# Altium schematic sheet ECAL-TEST-INPUT-OUTPUT.SchDoc
size A; SheetNumber: 2; SheetTotal: 5
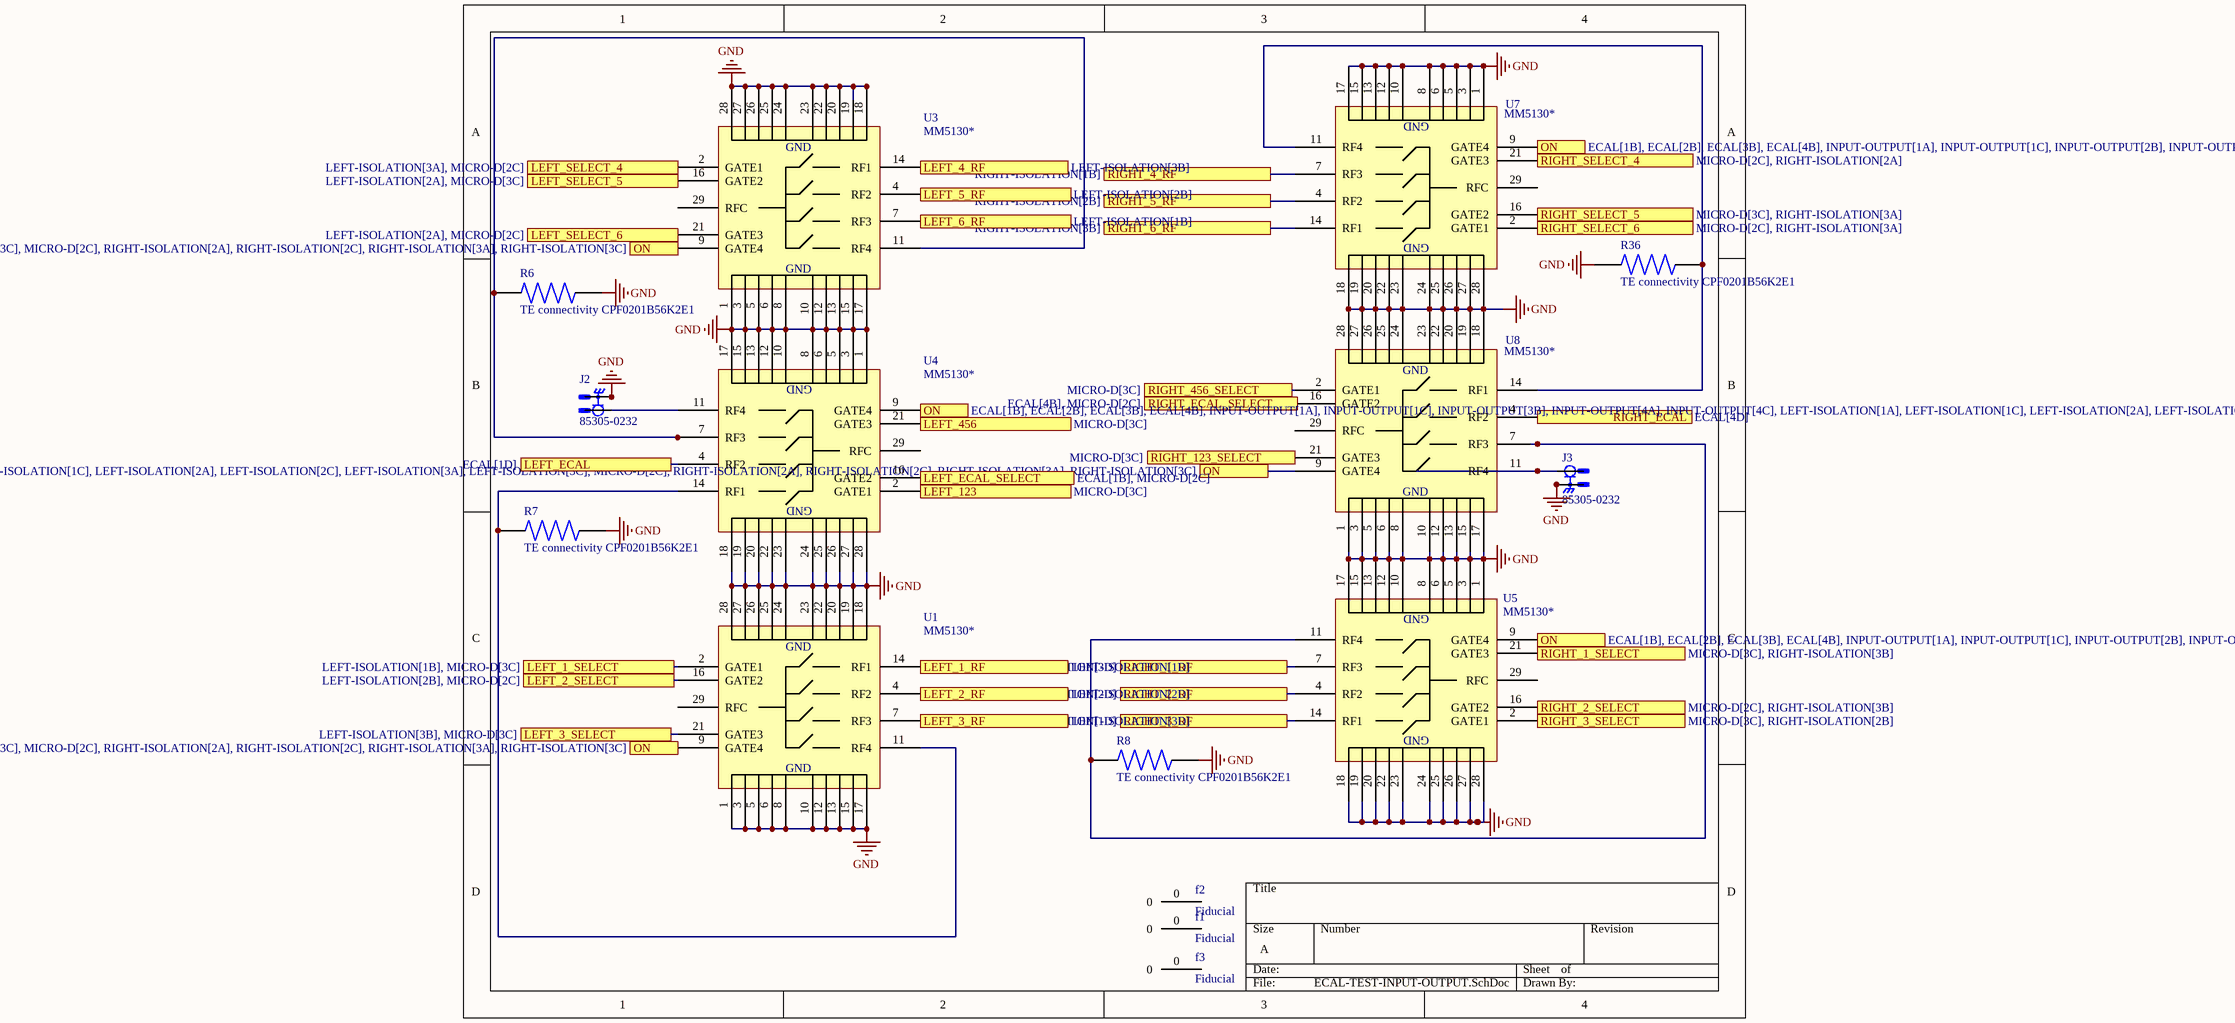
[diagram p0: ECAL-TEST-INPUT-OUTPUT.SchDoc]

## Parts
f1  Fiducial  [fiducial]
f2  Fiducial  [fiducial]
f3  Fiducial  [fiducial]
J2  85305-0232  [MOLEX_85305-0232]
J3  85305-0232  [MOLEX_85305-0232]
R6  TE connectivity CPF0201B56K2E1  [0201-resistor]
R7  TE connectivity CPF0201B56K2E1  [0201-resistor]
R8  TE connectivity CPF0201B56K2E1  [0201-resistor]
R36  TE connectivity CPF0201B56K2E1  [0201-resistor]
U1  MM5130*  [MM5130-NORM_PCB_NOFLOOD]
U3  MM5130*  [MM5130-NORM_PCB_NOFLOOD]
U4  MM5130*  [MM5130-NORM_PCB_NOFLOOD]
U5  MM5130*  [MM5130-NORM_PCB_NOFLOOD]
U7  MM5130*  [MM5130-NORM_PCB_NOFLOOD]
U8  MM5130*  [MM5130-NORM_PCB_NOFLOOD]

## Ports
LEFT_1_RF (see LEFT-ISOLATION[1D]), LEFT_1_SELECT (see LEFT-ISOLATION[1B], MICRO-D[3C]), LEFT_2_RF (see LEFT-ISOLATION[2D]), LEFT_2_SELECT (see LEFT-ISOLATION[2B], MICRO-D[2C]), LEFT_3_RF (see LEFT-ISOLATION[3D]), LEFT_3_SELECT (see LEFT-ISOLATION[3B], MICRO-D[3C]), LEFT_4_RF (see LEFT-ISOLATION[3B]), LEFT_5_RF (see LEFT-ISOLATION[2B]), LEFT_6_RF (see LEFT-ISOLATION[1B]), LEFT_123 (see MICRO-D[3C]), LEFT_456 (see MICRO-D[3C]), LEFT_ECAL (see ECAL[1D]), LEFT_ECAL_SELECT (see ECAL[1B], MICRO-D[2C]), LEFT_SELECT_4 (see LEFT-ISOLATION[3A], MICRO-D[2C]), LEFT_SELECT_5 (see LEFT-ISOLATION[2A], MICRO-D[3C]), LEFT_SELECT_6 (see LEFT-ISOLATION[2A], MICRO-D[2C]), ON (see ECAL[1B], ECAL[2B], ECAL[3B], ECAL[4B], INPUT-OUTPUT[1A], INPUT-OUTPUT[1C], INPUT-OUTPUT[2B], INPUT-OUTPUT[3B], INPUT-OUTPUT[4A], LEFT-ISOLATION[1A], LEFT-ISOLATION[1C], LEFT-ISOLATION[2A], LEFT-ISOLATION[2C], LEFT-ISOLATION[3A], LEFT-ISOLATION[3C], MICRO-D[2C], RIGHT-ISOLATION[2A], RIGHT-ISOLATION[2C], RIGHT-ISOLATION[3A], RIGHT-ISOLATION[3C]), ON (see ECAL[1B], ECAL[2B], ECAL[3B], ECAL[4B], INPUT-OUTPUT[1A], INPUT-OUTPUT[1C], INPUT-OUTPUT[2B], INPUT-OUTPUT[3B], INPUT-OUTPUT[4C], LEFT-ISOLATION[1A], LEFT-ISOLATION[1C], LEFT-ISOLATION[2A], LEFT-ISOLATION[2C], LEFT-ISOLATION[3A], LEFT-ISOLATION[3C], MICRO-D[2C], RIGHT-ISOLATION[2A], RIGHT-ISOLATION[2C], RIGHT-ISOLATION[3A], RIGHT-ISOLATION[3C]), ON (see ECAL[1B], ECAL[2B], ECAL[3B], ECAL[4B], INPUT-OUTPUT[1A], INPUT-OUTPUT[1C], INPUT-OUTPUT[2B], INPUT-OUTPUT[4A], INPUT-OUTPUT[4C], LEFT-ISOLATION[1A], LEFT-ISOLATION[1C], LEFT-ISOLATION[2A], LEFT-ISOLATION[2C], LEFT-ISOLATION[3A], LEFT-ISOLATION[3C], MICRO-D[2C], RIGHT-ISOLATION[2A], RIGHT-ISOLATION[2C], RIGHT-ISOLATION[3A], RIGHT-ISOLATION[3C]), ON (see ECAL[1B], ECAL[2B], ECAL[3B], ECAL[4B], INPUT-OUTPUT[1A], INPUT-OUTPUT[1C], INPUT-OUTPUT[3B], INPUT-OUTPUT[4A], INPUT-OUTPUT[4C], LEFT-ISOLATION[1A], LEFT-ISOLATION[1C], LEFT-ISOLATION[2A], LEFT-ISOLATION[2C], LEFT-ISOLATION[3A], LEFT-ISOLATION[3C], MICRO-D[2C], RIGHT-ISOLATION[2A], RIGHT-ISOLATION[2C], RIGHT-ISOLATION[3A], RIGHT-ISOLATION[3C]), ON (see ECAL[1B], ECAL[2B], ECAL[3B], ECAL[4B], INPUT-OUTPUT[1A], INPUT-OUTPUT[2B], INPUT-OUTPUT[3B], INPUT-OUTPUT[4A], INPUT-OUTPUT[4C], LEFT-ISOLATION[1A], LEFT-ISOLATION[1C], LEFT-ISOLATION[2A], LEFT-ISOLATION[2C], LEFT-ISOLATION[3A], LEFT-ISOLATION[3C], MICRO-D[2C], RIGHT-ISOLATION[2A], RIGHT-ISOLATION[2C], RIGHT-ISOLATION[3A], RIGHT-ISOLATION[3C]), ON (see ECAL[1B], ECAL[2B], ECAL[3B], ECAL[4B], INPUT-OUTPUT[1C], INPUT-OUTPUT[2B], INPUT-OUTPUT[3B], INPUT-OUTPUT[4A], INPUT-OUTPUT[4C], LEFT-ISOLATION[1A], LEFT-ISOLATION[1C], LEFT-ISOLATION[2A], LEFT-ISOLATION[2C], LEFT-ISOLATION[3A], LEFT-ISOLATION[3C], MICRO-D[2C], RIGHT-ISOLATION[2A], RIGHT-ISOLATION[2C], RIGHT-ISOLATION[3A], RIGHT-ISOLATION[3C]), RIGHT_1_RF (see RIGHT-ISOLATION[3D]), RIGHT_1_SELECT (see MICRO-D[3C], RIGHT-ISOLATION[3B]), RIGHT_2_RF (see RIGHT-ISOLATION[2D]), RIGHT_2_SELECT (see MICRO-D[2C], RIGHT-ISOLATION[3B]), RIGHT_3_RF (see RIGHT-ISOLATION[1D]), RIGHT_3_SELECT (see MICRO-D[3C], RIGHT-ISOLATION[2B]), RIGHT_4_RF (see RIGHT-ISOLATION[1B]), RIGHT_5_RF (see RIGHT-ISOLATION[2B]), RIGHT_6_RF (see RIGHT-ISOLATION[3B]), RIGHT_123_SELECT (see MICRO-D[3C]), RIGHT_456_SELECT (see MICRO-D[3C]), RIGHT_ECAL (see ECAL[4D]), RIGHT_ECAL_SELECT (see ECAL[4B], MICRO-D[2C]), RIGHT_SELECT_4 (see MICRO-D[2C], RIGHT-ISOLATION[2A]), RIGHT_SELECT_5 (see MICRO-D[3C], RIGHT-ISOLATION[3A]), RIGHT_SELECT_6 (see MICRO-D[2C], RIGHT-ISOLATION[3A])

## Nets
GND: J2.2 J2.3 J2.4 J2.5 J2.6 J2.7 J2.8 J2.9 J2.10 J2.11 J2.12 J2.13 J2.14 J2.15 J2.16 J2.17 J2.18 J3.2 J3.3 J3.4 J3.5 J3.6 J3.7 J3.8 J3.9 J3.10 J3.11 J3.12 J3.13 J3.14 J3.15 J3.16 J3.17 J3.18 R6.1 R7.1 R8.1 R36.1 U1.1(GND) U1.3(GND) U1.5(GND) U1.6(GND) U1.8(GND) U1.10(GND) U1.12(GND) U1.13(GND) U1.15(GND) U1.17(GND) U1.18(GND) U1.19(GND) U1.20(GND) U1.22(GND) U1.23(GND) U1.24(GND) U1.25(GND) U1.26(GND) U1.27(GND) U1.28(GND) U3.1(GND) U3.3(GND) U3.5(GND) U3.6(GND) U3.8(GND) U3.10(GND) U3.12(GND) U3.13(GND) U3.15(GND) U3.17(GND) U3.18(GND) U3.19(GND) U3.20(GND) U3.22(GND) U3.23(GND) U3.24(GND) U3.25(GND) U3.26(GND) U3.27(GND) U3.28(GND) U4.1(GND) U4.3(GND) U4.5(GND) U4.6(GND) U4.8(GND) U4.10(GND) U4.12(GND) U4.13(GND) U4.15(GND) U4.17(GND) U4.18(GND) U4.19(GND) U4.20(GND) U4.22(GND) U4.23(GND) U4.24(GND) U4.25(GND) U4.26(GND) U4.27(GND) U4.28(GND) U5.1(GND) U5.3(GND) U5.5(GND) U5.6(GND) U5.8(GND) U5.10(GND) U5.12(GND) U5.13(GND) U5.15(GND) U5.17(GND) U5.18(GND) U5.19(GND) U5.20(GND) U5.22(GND) U5.23(GND) U5.24(GND) U5.25(GND) U5.26(GND) U5.27(GND) U5.28(GND) U7.1(GND) U7.3(GND) U7.5(GND) U7.6(GND) U7.8(GND) U7.10(GND) U7.12(GND) U7.13(GND) U7.15(GND) U7.17(GND) U7.18(GND) U7.19(GND) U7.20(GND) U7.22(GND) U7.23(GND) U7.24(GND) U7.25(GND) U7.26(GND) U7.27(GND) U7.28(GND) U8.1(GND) U8.3(GND) U8.5(GND) U8.6(GND) U8.8(GND) U8.10(GND) U8.12(GND) U8.13(GND) U8.15(GND) U8.17(GND) U8.18(GND) U8.19(GND) U8.20(GND) U8.22(GND) U8.23(GND) U8.24(GND) U8.25(GND) U8.26(GND) U8.27(GND) U8.28(GND)
LEFT_1_RF: U1.14(RF1) ; port LEFT_1_RF
LEFT_1_SELECT: U1.2(GATE1) ; port LEFT_1_SELECT
LEFT_2_RF: U1.4(RF2) ; port LEFT_2_RF
LEFT_2_SELECT: U1.16(GATE2) ; port LEFT_2_SELECT
LEFT_3_RF: U1.7(RF3) ; port LEFT_3_RF
LEFT_3_SELECT: U1.21(GATE3) ; port LEFT_3_SELECT
LEFT_4_RF: U3.14(RF1) ; port LEFT_4_RF
LEFT_5_RF: U3.4(RF2) ; port LEFT_5_RF
LEFT_6_RF: U3.7(RF3) ; port LEFT_6_RF
LEFT_123: U4.2(GATE1) ; port LEFT_123
LEFT_456: U4.21(GATE3) ; port LEFT_456
LEFT_ECAL: U4.4(RF2) ; port LEFT_ECAL
LEFT_ECAL_SELECT: U4.16(GATE2) ; port LEFT_ECAL_SELECT
LEFT_SELECT_4: U3.2(GATE1) ; port LEFT_SELECT_4
LEFT_SELECT_5: U3.16(GATE2) ; port LEFT_SELECT_5
LEFT_SELECT_6: U3.21(GATE3) ; port LEFT_SELECT_6
ON: U1.9(GATE4) U3.9(GATE4) U4.9(GATE4) U5.9(GATE4) U7.9(GATE4) U8.9(GATE4) ; port ON
RIGHT_1_RF: U5.7(RF3) ; port RIGHT_1_RF
RIGHT_1_SELECT: U5.21(GATE3) ; port RIGHT_1_SELECT
RIGHT_2_RF: U5.4(RF2) ; port RIGHT_2_RF
RIGHT_2_SELECT: U5.16(GATE2) ; port RIGHT_2_SELECT
RIGHT_3_RF: U5.14(RF1) ; port RIGHT_3_RF
RIGHT_3_SELECT: U5.2(GATE1) ; port RIGHT_3_SELECT
RIGHT_4_RF: U7.7(RF3) ; port RIGHT_4_RF
RIGHT_5_RF: U7.4(RF2) ; port RIGHT_5_RF
RIGHT_6_RF: U7.14(RF1) ; port RIGHT_6_RF
RIGHT_123_SELECT: U8.21(GATE3) ; port RIGHT_123_SELECT
RIGHT_456_SELECT: U8.2(GATE1) ; port RIGHT_456_SELECT
RIGHT_ECAL: U8.4(RF2) ; port RIGHT_ECAL
RIGHT_SELECT_4: U7.21(GATE3) ; port RIGHT_SELECT_4
RIGHT_SELECT_5: U7.16(GATE2) ; port RIGHT_SELECT_5
RIGHT_SELECT_6: U7.2(GATE1) ; port RIGHT_SELECT_6
NetJ2_1: J2.1 U4.11(RF4)
NetJ3_1: J3.1 U8.11(RF4)
NetR6_2: R6.2 U3.11(RF4) U4.7(RF3)
NetR7_2: R7.2 U1.11(RF4) U4.14(RF1)
NetR8_2: R8.2 U5.11(RF4) U8.7(RF3)
NetR36_2: R36.2 U7.11(RF4) U8.14(RF1)

Not connected (* = marked no-connect by the designer): f1 0; f2 0; f3 0; U1 29(RFC); U3 29(RFC); U4 29(RFC); U5 29(RFC); U7 29(RFC); U8 16(GATE2) 29(RFC)

## Library data of the parts
J2 J3 = 85305-0232: SMP Connector Plug, Male Pin 50Ohm Surface Mount Solder; MP: 853050232; MF: Molex; Check_prices: https://www.snapeda.com/parts/853050232/Molex/view-part/?ref=eda; Value: *; Availability: In Stock; Price: None; Package: None; SnapEDA_Link: https://www.snapeda.com/parts/853050232/Molex/view-part/?ref=snap; Purchase-URL: https://pricing.snapeda.com/search/part/853050232/?ref=eda
R6-R8 R36 = TE connectivity CPF0201B56K2E1: CPF 0201 56K2 0.1% 25PPM 1K RL; MP: ERJ1GN0R00C; Value: 56k; Availability: Unavailable; Price: None; Package: None; Mfgr: TE connectivity; Mfgr Part No.: CPF0201B56K2E1
U1 U3-U5 U7 U8 = IC-MM5130: High power SP4T MEMs switch